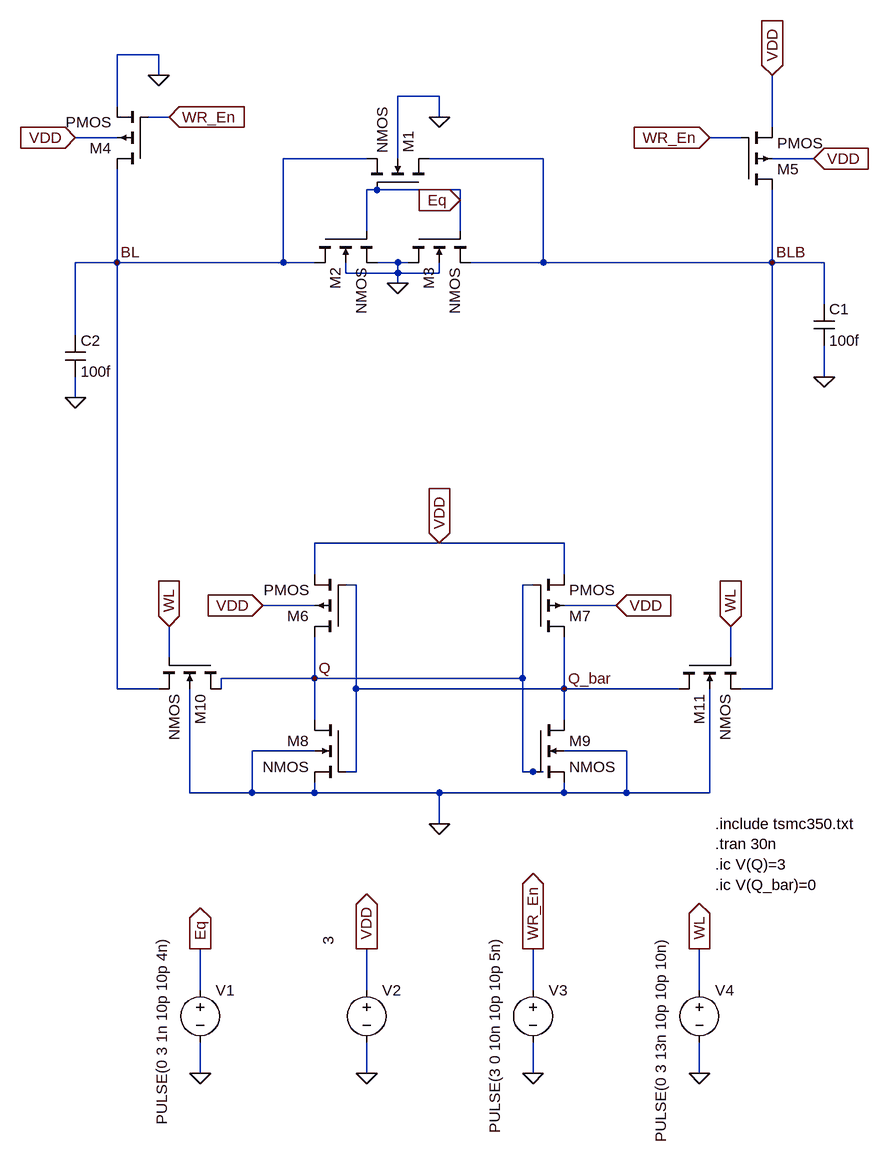
[diagram p0: schematic lab8t1.asc]
lab8t1.asc, the LTspice schematic file:
Version 4
SHEET 1 2588 1668
WIRE 128 -16 64 -16
WIRE 128 16 128 -16
WIRE 560 48 496 48
WIRE 64 64 64 -16
WIRE 144 80 112 80
WIRE 560 80 560 48
WIRE 1072 96 1072 16
WIRE 64 112 0 112
WIRE 1024 112 976 112
WIRE 448 144 320 144
WIRE 496 144 496 48
WIRE 720 144 544 144
WIRE 1136 144 1072 144
WIRE 464 192 448 192
WIRE 592 192 464 192
WIRE 592 208 592 192
WIRE 448 256 448 192
WIRE 592 256 592 208
WIRE 64 304 64 160
WIRE 64 304 0 304
WIRE 320 304 320 144
WIRE 320 304 64 304
WIRE 368 304 320 304
WIRE 496 304 464 304
WIRE 512 304 496 304
WIRE 720 304 720 144
WIRE 720 304 608 304
WIRE 1072 304 1072 192
WIRE 1072 304 720 304
WIRE 1152 304 1072 304
WIRE 416 320 416 304
WIRE 496 320 496 304
WIRE 496 320 416 320
WIRE 560 320 560 304
WIRE 560 320 496 320
WIRE 496 336 496 320
WIRE 1152 368 1152 304
WIRE 0 416 0 304
WIRE 1152 480 1152 432
WIRE 0 512 0 480
WIRE 560 736 368 736
WIRE 752 736 560 736
WIRE 368 784 368 736
WIRE 752 784 752 736
WIRE 432 800 416 800
WIRE 704 800 688 800
WIRE 368 832 288 832
WIRE 832 832 752 832
WIRE 144 912 144 864
WIRE 1008 912 1008 864
WIRE 368 944 368 880
WIRE 368 944 224 944
WIRE 688 944 688 800
WIRE 688 944 368 944
WIRE 64 960 64 304
WIRE 128 960 64 960
WIRE 224 960 224 944
WIRE 432 960 432 800
WIRE 752 960 752 880
WIRE 752 960 432 960
WIRE 928 960 752 960
WIRE 1072 960 1072 304
WIRE 1072 960 1024 960
WIRE 368 1008 368 944
WIRE 752 1008 752 960
WIRE 368 1056 272 1056
WIRE 848 1056 752 1056
WIRE 432 1088 432 960
WIRE 432 1088 416 1088
WIRE 688 1088 688 944
WIRE 704 1088 688 1088
WIRE 720 1088 704 1088
WIRE 176 1120 176 960
WIRE 272 1120 272 1056
WIRE 272 1120 176 1120
WIRE 368 1120 368 1104
WIRE 368 1120 272 1120
WIRE 560 1120 368 1120
WIRE 752 1120 752 1104
WIRE 752 1120 560 1120
WIRE 848 1120 848 1056
WIRE 848 1120 752 1120
WIRE 976 1120 976 960
WIRE 976 1120 848 1120
WIRE 560 1168 560 1120
WIRE 192 1424 192 1360
WIRE 448 1424 448 1360
WIRE 704 1424 704 1360
WIRE 960 1424 960 1360
WIRE 192 1552 192 1504
WIRE 448 1552 448 1504
WIRE 704 1552 704 1504
WIRE 960 1552 960 1504
FLAG 496 336 0
FLAG 0 512 0
FLAG 1152 480 0
FLAG 560 80 0
FLAG 560 1168 0
FLAG 192 1552 0
FLAG 192 1360 Eq
IOPIN 192 1360 Out
FLAG 448 1552 0
FLAG 448 1360 VDD
IOPIN 448 1360 Out
FLAG 704 1552 0
FLAG 704 1360 WR_En
IOPIN 704 1360 Out
FLAG 960 1552 0
FLAG 960 1360 WL
IOPIN 960 1360 Out
FLAG 0 112 VDD
IOPIN 0 112 In
FLAG 144 80 WR_En
IOPIN 144 80 In
FLAG 64 304 BL
FLAG 592 208 Eq
IOPIN 592 208 In
FLAG 976 112 WR_En
IOPIN 976 112 In
FLAG 1136 144 VDD
IOPIN 1136 144 In
FLAG 1072 304 BLB
FLAG 560 736 VDD
IOPIN 560 736 In
FLAG 288 832 VDD
IOPIN 288 832 In
FLAG 832 832 VDD
IOPIN 832 832 In
FLAG 368 944 Q
FLAG 752 960 Q_bar
FLAG 144 864 WL
IOPIN 144 864 In
FLAG 1008 864 WL
IOPIN 1008 864 In
FLAG 128 16 0
FLAG 1072 16 VDD
IOPIN 1072 16 In
SYMBOL nmos4 544 192 M270
SYMATTR InstName M1
SYMATTR Value2 l=350n w=1u
SYMBOL nmos4 368 256 M90
SYMATTR InstName M2
SYMATTR Value2 l=350n w=1u
SYMBOL nmos4 512 256 M90
SYMATTR InstName M3
SYMATTR Value2 l=350n w=1u
SYMBOL pmos4 112 160 R180
SYMATTR InstName M4
SYMATTR Value2 l=350n w=10u
SYMBOL pmos4 1024 192 M180
SYMATTR InstName M5
SYMATTR Value2 l=350n w=10u
SYMBOL Cap 1136 368 R0
SYMATTR InstName C1
SYMATTR Value 100f
SYMBOL Cap -16 416 R0
SYMATTR InstName C2
SYMATTR Value 100f
SYMBOL pmos4 416 880 R180
SYMATTR InstName M6
SYMATTR Value2 l=350n w=1u
SYMBOL pmos4 704 880 M180
SYMATTR InstName M7
SYMATTR Value2 l=350n w=1u
SYMBOL nmos4 416 1008 M0
SYMATTR InstName M8
SYMATTR Value2 l=350n w=500n
SYMBOL nmos4 704 1008 R0
SYMATTR InstName M9
SYMATTR Value2 l=350n w=500n
SYMBOL nmos4 224 912 R90
SYMATTR InstName M10
SYMATTR Value2 l=350n w=500n
SYMBOL nmos4 928 912 M90
SYMATTR InstName M11
SYMATTR Value2 l=350n w=500n
SYMBOL Voltage 192 1408 R0
WINDOW 3 -59 -67 VRight 2
SYMATTR Value PULSE(0 3 1n 10p 10p 4n)
SYMATTR InstName V1
SYMBOL Voltage 448 1408 R0
WINDOW 3 -59 -67 VRight 2
SYMATTR Value 3
SYMATTR InstName V2
SYMBOL Voltage 704 1408 R0
WINDOW 3 -59 -67 VRight 2
SYMATTR Value PULSE(3 0 10n 10p 10p 5n)
SYMATTR InstName V3
SYMBOL Voltage 960 1408 R0
WINDOW 3 -59 -67 VRight 2
SYMATTR Value PULSE(0 3 13n 10p 10p 10n)
SYMATTR InstName V4
TEXT 984 1168 Left 2 !.include tsmc350.txt\n.tran 30n\n.ic V(Q)=3\n.ic V(Q_bar)=0

The netlist it stands for:
* lab8t1.asc
M1 BLB Eq BL 0 NMOS l=350n w=1u
M2 BL Eq 0 0 NMOS l=350n w=1u
M3 0 Eq BLB 0 NMOS l=350n w=1u
M4 BL WR_En 0 VDD PMOS l=350n w=10u
M5 BLB WR_En VDD VDD PMOS l=350n w=10u
C1 BLB 0 100f
C2 BL 0 100f
M6 Q Q_bar VDD VDD PMOS l=350n w=1u
M7 Q_bar Q VDD VDD PMOS l=350n w=1u
M8 Q Q_bar 0 0 NMOS l=350n w=500n
M9 Q_bar Q 0 0 NMOS l=350n w=500n
M10 Q WL BL 0 NMOS l=350n w=500n
M11 Q_bar WL BLB 0 NMOS l=350n w=500n
V1 Eq 0 PULSE(0 3 1n 10p 10p 4n)
V2 VDD 0 3
V3 WR_En 0 PULSE(3 0 10n 10p 10p 5n)
V4 WL 0 PULSE(0 3 13n 10p 10p 10n)
.model NMOS NMOS
.model PMOS PMOS
.lib standard.mos
.include tsmc350.txt
.tran 30n
.ic V(Q)=3
.ic V(Q_bar)=0
.backanno
.end